# Altium project Luchador Rev 3.2old.PrjPcb
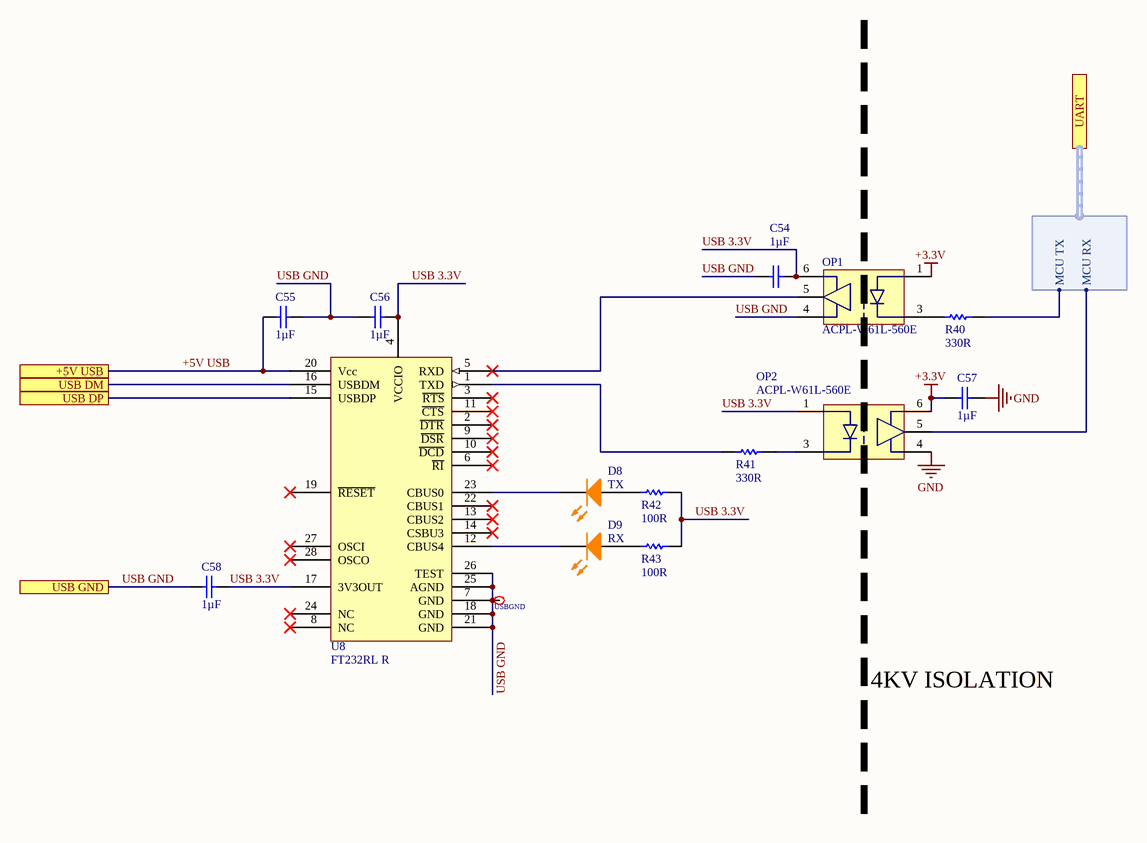
[diagram p0: Isolated USB.SchDoc]
PCBDOC: XXXXXX; PCBREV: 3.2b; PRJCOMPANY: X; PRJDATE: 3-15-19; PRJDOC: XXXXXX; PRJENGINEER: N. HAMAN; PRJNAME: AMBER; PRJREV: 3.2b
2 sheets, 35 parts. Net scope: hierarchical (ports join the sheet entries above them; power ports are global).
Board file: Luchador Pcb.PcbDoc
Sheets:
  Isolated USB.SchDoc
  DAQ System.SchDoc

## Sheet Isolated USB.SchDoc
size A4; SheetNumber: 4; SheetTotal: 11; TitleBlk1Sch: PCBA, LUCHADOR, REV 3.2b, AMBER; TitleBlk2Sch: Isolated USB; Eng: Haman; EngDate: 3-15-19; RevSch: 01

### Parts
C54  Capacitance: 1µF  [0402C]  (hidden comment: 50V)
C55  Capacitance: 1µF  [0402C]  (hidden comment: 50V)
C56  Capacitance: 1µF  [0402C]  (hidden comment: 50V)
C57  Capacitance: 1µF  [0402C]  (hidden comment: 50V)
C58  Capacitance: 1µF  [0402C]  (hidden comment: 50V)
D8  TX  [0402L-ORANGE]
D9  RX  [0402L-ORANGE]
OP1  ACPL-W61L-560E  [SO-6S]
OP2  ACPL-W61L-560E  [SO-6S]
R40  Resistance: 330R  [0402R]  (hidden comment: Res 0805)
R41  Resistance: 330R  [0402R]  (hidden comment: Res 0805)
R42  Resistance: 100R  [0402R]  (hidden comment: Res 0805)
R43  Resistance: 100R  [0402R]  (hidden comment: Res 0805)
U8  FT232RL R  [FTDI-28]
USBGND  5001  [KEYSTONE TP]  (value not drawn)  (no BOM)

### Ports
+5V USB, UART (harness UART), USB DM, USB DP, USB GND

### Harnesses
UART: MCU TX, MCU RX

### Nets
+3.3V: C57.1 OP1.1(A) OP2.6(Vdd)
GND: C57.2 OP2.4(GND)
+5V USB: C55.1 U8.20(Vcc) ; port +5V USB
USB 3.3V: C54.2 C56.2 C58.2 OP1.6(Vdd) OP2.1(A) R42.2 R43.2 U8.4(VCCIO) U8.17(3V3OUT)
USB GND: C54.1 C55.2 C56.1 C58.1 OP1.4(GND) U8.7(GND) U8.18(GND) U8.21(GND) U8.25(AGND) U8.26(TEST) USBGND.1 ; port USB GND
NetD8_1: D8.1(A) R42.1
NetD8_2: D8.2(K) U8.23(CBUS0)
NetD9_1: D9.1(A) R43.1
NetD9_2: D9.2(K) U8.12(CBUS4)
NetOP1_3: OP1.3(C) R40.1
NetOP1_5: OP1.5(Vo) U8.5(RXD)
NetOP2_3: OP2.3(C) R41.2
NetOP2_5: OP2.5(Vo) ; port UART.MCU RX
NetR40_2: R40.2 ; port UART.MCU TX
NetR41_1: R41.1 U8.1(TXD)
NetU8_15: U8.15(USBDP) ; port USB DP
NetU8_16: U8.16(USBDM) ; port USB DM

Not connected (* = marked no-connect by the designer): U8 2(~{DTR})* 3(~{RTS})* 6(~{RI})* 8(NC)* 9(~{DSR})* 10(~{DCD})* 11(~{CTS})* 13(CBUS2)* 14(CSBU3)* 19(~{RESET})* 22(CBUS1)* 24(NC)* 27(OSCI)* 28(OSCO)*

### Notes on the sheet
- 4KV ISOLATION
- Title:
- USA
- 100 Mayfield Avenue
- Mountain View, CA 94043
- Variant Name:
- Confidential and Proprietary
- Engineer:
- Date:
- Size:
- A4
- Template:
- 992-00283-00 A
- Dwg No:
- Sheet:
- Rev:
- of

### Library data of the parts
C54-C58 = Cap: CAP .1UF 50V CERAMIC Y5V 0805; Manufacturer: TDK; Manufacturer Part Number: CGB2A1JB1C105K033BC; PCN Part Number: MLCC Part Number Change 30/Nov/2012; Description1: 1µF ±10% 16V JB Ceramic Capacitor -25°C ~ 85°C Surface Mount, MLCC 0402 (1005 Metric) 0.039" L x 0.020" W (1.00mm x 0.50mm); Product Training Modules: SEAT, CCV, and TVCL Design Tools Guide to Replacing an Electrolytic Capacitor with an MLCC; Featured Product: CGB Series Capacitors CH and JB Temperature Coefficient Capacitors; EDA / CAD Models: Download from Accelerated Designs; Tolerance: ±10%; Voltage - Rated: 16V; Temperature Coefficient: JB; Online Catalog: CGB Series; Other Names: 445-12011-6; Revision: July-2002: Re-released for DXP Platform.; Supplier 1: Digi-Key; Supplier Part Number 1: 445-12011-1-ND; Stock 1: 7430; Pricing 1: 1=0.22, 10=0.151, 100=0.0765, 500=0.0523, 1000=0.0463, 2500=0.0443, 5000=0.0403 (USD); RoHS Information: RoHS Certificate-MLCC; Standard Package: 1; Category: Capacitors; Family: Ceramic Capacitors; Series: CGB; Packaging: Digi-Reel®; Mounting Type: Surface Mount, MLCC; Operating Temperature: -25°C ~ 85°C; Applications: General Purpose; Package / Case: 0402 (1005 Metric); Size / Dimension: 0.039" L x 0.020" W (1.00mm x 0.50mm); Thickness (Max): 0.013" (0.33mm); Features: Low Profile; ComponentLink1URL: https://product.tdk.com/info/en/catalog/datasheets/mlcc_commercial_lowprofile_en.pdf; ComponentLink1Description: https://product.tdk.com/info/en/catalog/datasheets/mlcc_commercial_lowprofile_en.pdf; ComponentLink2URL: https://product.tdk.com/info/en/catalog/spec/mlccspec_commercial_lowprofile_en.pdf; ComponentLink2Description: https://product.tdk.com/info/en/catalog/spec/mlccspec_commercial_lowprofile_en.pdf; ComponentLink3URL: http://product.tdk.com/en/catalog/datasheets/mlcc_commercial_lowprofile_en.pdf; ComponentLink3Description: http://product.tdk.com/en/catalog/datasheets/mlcc_commercial_lowprofile_en.pdf
D8 D9 = LED0_1: Typical INFRARED GaAs LED; Manufacturer: Vishay; Manufacturer Part Number: VLMO1500-GS08; Description1: Standard LEDs - SMD 0402 SOFT ORANGE Non-Diff; Illumination Color: Orange; Wavelength/Color Temperature: 605 nm; Luminous Intensity: 90 mcd; Viewing Angle: 130 deg; Lens Color/Style: Water Clear; If - Forward Current: 30 mA; Vf - Forward Voltage: 2 V; Power Rating: 75 mW; Brand: Vishay Semiconductors; Supplier 1: Digi-Key; Supplier Part Number 1: VLMO1500-GS08CT-ND; Stock 1: 194938; Pricing 1: 1=0.53, 10=0.38, 25=0.2916, 100=0.1901, 250=0.1394, 500=0.1183, 1000=0.0972 (USD); Product Category: Standard LEDs - SMD; RoHS: True; Package / Case: 0402 (1005 metric); Length: 1 mm; Height: 0.35 mm; Width: 0.5 mm; Minimum Operating Temperature: - 30 C; Maximum Operating Temperature: + 85 C; Series: VLMx; Packaging: Reel; Mounting Style: SMD/SMT; Factory Pack Quantity: 9000; Tradename: ChipLED; ComponentLink1URL: https://datasheet.ciiva.com/13945/vlmo1500-13945355.pdf; ComponentLink1Description: https://datasheet.ciiva.com/13945/vlmo1500-13945355.pdf; ComponentLink2URL: https://datasheet.ciiva.com/13945/vlmo1500-13945356.pdf; ComponentLink2Description: https://datasheet.ciiva.com/13945/vlmo1500-13945356.pdf; ComponentLink3URL: https://datasheet.ciiva.com/13945/vlmo1500-13945357.pdf; ComponentLink3Description: https://datasheet.ciiva.com/13945/vlmo1500-13945357.pdf
OP1 OP2 = ACPL-W61L-560E: Manufacturer: Broadcom Limited; Description1: OPTOISO 5KV PUSH PULL 6SO; Inputs - Side 1/Side 2: 1/0; Voltage - Isolation: 5000Vrms; Common Mode Transient Immunity (Min): 20kV/µs; Input Type: DC; Output Type: Push-Pull, Totem Pole; Data Rate: 10MBd; Propagation Delay tpLH / tpHL (Max): 80ns, 80ns; Rise / Fall Time (Typ): 12ns, 12ns; Voltage - Forward (Vf) (Typ): 1.3V; Current - DC Forward (If) (Max): 8mA; Voltage - Supply: 2.7 V ~ 5.5 V; Supplier 1: Digi-Key; Supplier Part Number 1: 516-2633-1-ND; RoHS: RoHS Compliant; Category: Isolators; Stock 1: 23625; Pricing 1: 1=3.6, 10=3, 25=2.52, 100=2.1598, 250=1.91984, 500=1.73986 (USD); Packaging: Cut Tape (CT); Part Status: Active; Operating Temperature: -40°C ~ 105°C; Mounting Type: Surface Mount; Package / Case: 6-SOIC (0.180", 4.58mm Width); Supplier Device Package: 6-SO Stretched; ComponentLink1URL: https://docs.broadcom.com/docs/AV02-2150EN; ComponentLink1Description: https://docs.broadcom.com/docs/AV02-2150EN; Manufacturer Part Number: ACPL-W61L-560E
R40 R41 = Res 0805: Resistor; Manufacturer: Panasonic; Manufacturer Part Number: ERJ-2RKF3300X; Description1: Res Thick Film 0402 330 Ohm 1% 0.1W(1/10W) ±100ppm/C Molded SMD Automotive Punched T/R; Resistor Element Type: Thick Film; Product Range: PANASONIC - ERJ Series; Power Rating: 100mW; Resistance Tolerance: ± 1%; Resistor Case Style: 0402 [1005 Metric]; Temperature Coefficient: ± 100ppm/°C; Voltage Rating: 50V; SVHC: Diboron trioxide (19-Dec-2012); Resistor Mounting: SMD; Resistor Terminals: Wraparound; SVHC (Secondary): Lead monoxide (lead oxide) (19-Dec-2012); Supplier 1: Digi-Key; Supplier Part Number 1: P330LCT-ND; Stock 1: 634394; Pricing 1: 1=0.1, 10=0.056, 100=0.0227, 1000=0.0102, 2500=0.0089, 5000=0.0073 (USD); Resistor Element Material: Thick Film; Packaging: Cut Tape; MSL: (Not Applicable); ComponentLink1URL: https://datasheet.ciiva.com/11821/0900766b80f80784-11821296.pdf; ComponentLink1Description: https://datasheet.ciiva.com/11821/0900766b80f80784-11821296.pdf; ComponentLink2URL: https://datasheet.ciiva.com/16765/70260748-16765702.pdf; ComponentLink2Description: https://datasheet.ciiva.com/16765/70260748-16765702.pdf; ComponentLink3URL: https://datasheet.ciiva.com/17206/aoa0000ce2-17206150.pdf; ComponentLink3Description: https://datasheet.ciiva.com/17206/aoa0000ce2-17206150.pdf; ComponentLink4URL: https://datasheet.ciiva.com/30088/aoa0000ce2-30088246.pdf; ComponentLink4Description: https://datasheet.ciiva.com/30088/aoa0000ce2-30088246.pdf; ComponentLink5URL: https://datasheet.ciiva.com/6138/aoa0000ce2-6138743.pdf; ComponentLink5Description: https://datasheet.ciiva.com/6138/aoa0000ce2-6138743.pdf; ComponentLink6URL: https://datasheet.ciiva.com/46373/1678782-46373913.pdf; ComponentLink6Description: https://datasheet.ciiva.com/46373/1678782-46373913.pdf; ComponentLink7URL: https://datasheet.ciiva.com/7887/aoa0000ce2-7887018.pdf; ComponentLink7Description: https://datasheet.ciiva.com/7887/aoa0000ce2-7887018.pdf; ComponentLink8URL: https://datasheet.ciiva.com/46373/1678782-46373914.pdf; ComponentLink8Description: https://datasheet.ciiva.com/46373/1678782-46373914.pdf; ComponentLink9URL: https://datasheet.ciiva.com/16426/aoa0000ce2-16426749.pdf; ComponentLink9Description: https://datasheet.ciiva.com/16426/aoa0000ce2-16426749.pdf; ComponentLink10URL: https://datasheet.ciiva.com/7886/aoa0000ce2-7886718.pdf; ComponentLink10Description: https://datasheet.ciiva.com/7886/aoa0000ce2-7886718.pdf; ComponentLink11URL: https://datasheet.ciiva.com/22706/1678782-22706926.pdf; ComponentLink11Description: https://datasheet.ciiva.com/22706/1678782-22706926.pdf
R42 R43 = Res 0805: Resistor; Manufacturer: Panasonic; Manufacturer Part Number: ERJ-2RKF1000X; Description1: Res Thick Film 0402 100 Ohm 1% 0.1W(1/10W) ±100ppm/C Molded SMD Automotive T/R; Rated Power: 0.1 W; Tolerance (%): ±1 %; Temp Coefficient: ±100 ppm/°C; Supplier 1: Digi-Key; Supplier Part Number 1: P100LCT-ND; Stock 1: 14075966; Pricing 1: 1=0.1, 10=0.056, 100=0.0227, 1000=0.0102, 2500=0.0089, 5000=0.0073 (USD); Size Code: 0402; ComponentLink1URL: https://datasheet.ciiva.com/27056/2007311-27056035.pdf; ComponentLink1Description: https://datasheet.ciiva.com/27056/2007311-27056035.pdf; ComponentLink2URL: https://datasheet.ciiva.com/11821/0900766b80f80784-11821173.pdf; ComponentLink2Description: https://datasheet.ciiva.com/11821/0900766b80f80784-11821173.pdf; ComponentLink3URL: https://datasheet.ciiva.com/46372/1678782-46372741.pdf; ComponentLink3Description: https://datasheet.ciiva.com/46372/1678782-46372741.pdf; ComponentLink4URL: https://datasheet.ciiva.com/16199/aoa0000ce2-16199575.pdf; ComponentLink4Description: https://datasheet.ciiva.com/16199/aoa0000ce2-16199575.pdf; ComponentLink5URL: https://datasheet.ciiva.com/43467/1678782-43467223.pdf; ComponentLink5Description: https://datasheet.ciiva.com/43467/1678782-43467223.pdf; ComponentLink6URL: https://datasheet.ciiva.com/30260/aoa0000ce2-30260809.pdf; ComponentLink6Description: https://datasheet.ciiva.com/30260/aoa0000ce2-30260809.pdf; ComponentLink7URL: https://datasheet.ciiva.com/9186/aoa0000ce2-9186683.pdf; ComponentLink7Description: https://datasheet.ciiva.com/9186/aoa0000ce2-9186683.pdf; ComponentLink8URL: https://datasheet.ciiva.com/16776/70260748-16776427.pdf; ComponentLink8Description: https://datasheet.ciiva.com/16776/70260748-16776427.pdf; ComponentLink9URL: https://datasheet.ciiva.com/48531/aoa0000ce2-48531067.pdf; ComponentLink9Description: https://datasheet.ciiva.com/48531/aoa0000ce2-48531067.pdf; ComponentLink10URL: https://datasheet.ciiva.com/17207/aoa0000ce2-17207980.pdf; ComponentLink10Description: https://datasheet.ciiva.com/17207/aoa0000ce2-17207980.pdf; ComponentLink11URL: https://datasheet.ciiva.com/7830/426256-7830973.pdf; ComponentLink11Description: https://datasheet.ciiva.com/7830/426256-7830973.pdf; ComponentLink12URL: https://datasheet.ciiva.com/16522/aoa0000ce2-16522621.pdf; ComponentLink12Description: https://datasheet.ciiva.com/16522/aoa0000ce2-16522621.pdf; ComponentLink13URL: https://datasheet.ciiva.com/28514/1678782-28514175.pdf; ComponentLink13Description: https://datasheet.ciiva.com/28514/1678782-28514175.pdf
U8 = FT232RL R: IC USB TO SERIAL UART 28-SSOP; Manufacturer: FTDI, Future Technology Devices International Ltd; Manufacturer Part Number: FT232RL-REEL; Description1: IC USB FS SERIAL UART 28-SSOP; Number of Channels: 1, UART; FIFO's: 256 Byte; Protocol: RS-232, RS-422, RS-485; Voltage - Supply: 3.3 V ~ 5.25 V; With Auto Flow Control: Yes; Supplier 1: Digi-Key; Supplier Part Number 1: 768-1007-1-ND; RoHS: RoHS Compliant; Category: Integrated Circuits (ICs); Stock 1: 60399; Pricing 1: 1=4.5, 10=4.05, 50=3.85, 100=3.65, 250=3.25, 500=2.85 (USD); Features: USB to UART; With Parallel Port: -; With IrDA Encoder/Decoder: -; With False Start Bit Detection: -; With Modem Control: Yes; With CMOS: Yes; Mounting Type: Surface Mount; Package / Case: 28-SSOP; Supplier Device Package: 28-SSOP; Packaging: Cut Tape (CT); ComponentLink1URL: http://www.ftdichip.com/Support/Documents/DataSheets/ICs/DS_FT232R.pdf; ComponentLink1Description: http://www.ftdichip.com/Support/Documents/DataSheets/ICs/DS_FT232R.pdf
USBGND = 5001: Manufacturer: Keystone Electronics; Description1: TEST POINT PC MINI .040"D BLACK; Supplier 1: Digi-Key; Manufacturer Part Number: 5001; RoHS: RoHS Compliant; Category: Test and Measurement; Stock 1: 159085; Pricing 1: 1=0.34, 10=0.315, 50=0.2296, 100=0.2206, 250=0.19812, 500=0.1891, 1000=0.15759, 2500=0.14408, 5000=0.13508 (USD); Packaging: Bulk; Type: PC Test Point, Miniature; Terminal: 0.010" x 0.020" (0.25mm x 0.51mm) Phosphor Bronze Wire, Silver Plated; Mounting Type: 0.040" (1.02mm) Hole Diameter; Material: Base, Nylon 46, UL 94V-0; Color: Black; ComponentLink1URL: http://www.keyelco.com/product-pdf.cfm?p=1310; ComponentLink1Description: http://www.keyelco.com/product-pdf.cfm?p=1310; Supplier Part Number 1: 5001K-ND

## Sheet DAQ System.SchDoc
size B; SheetNumber: 5; SheetTotal: 11; TitleBlk1Sch: PCBA, LUCHADOR, REV 3.2b, AMBER; TitleBlk2Sch: DAQ System; Eng: Haman; EngDate: 3-15-19; RevSch: 01
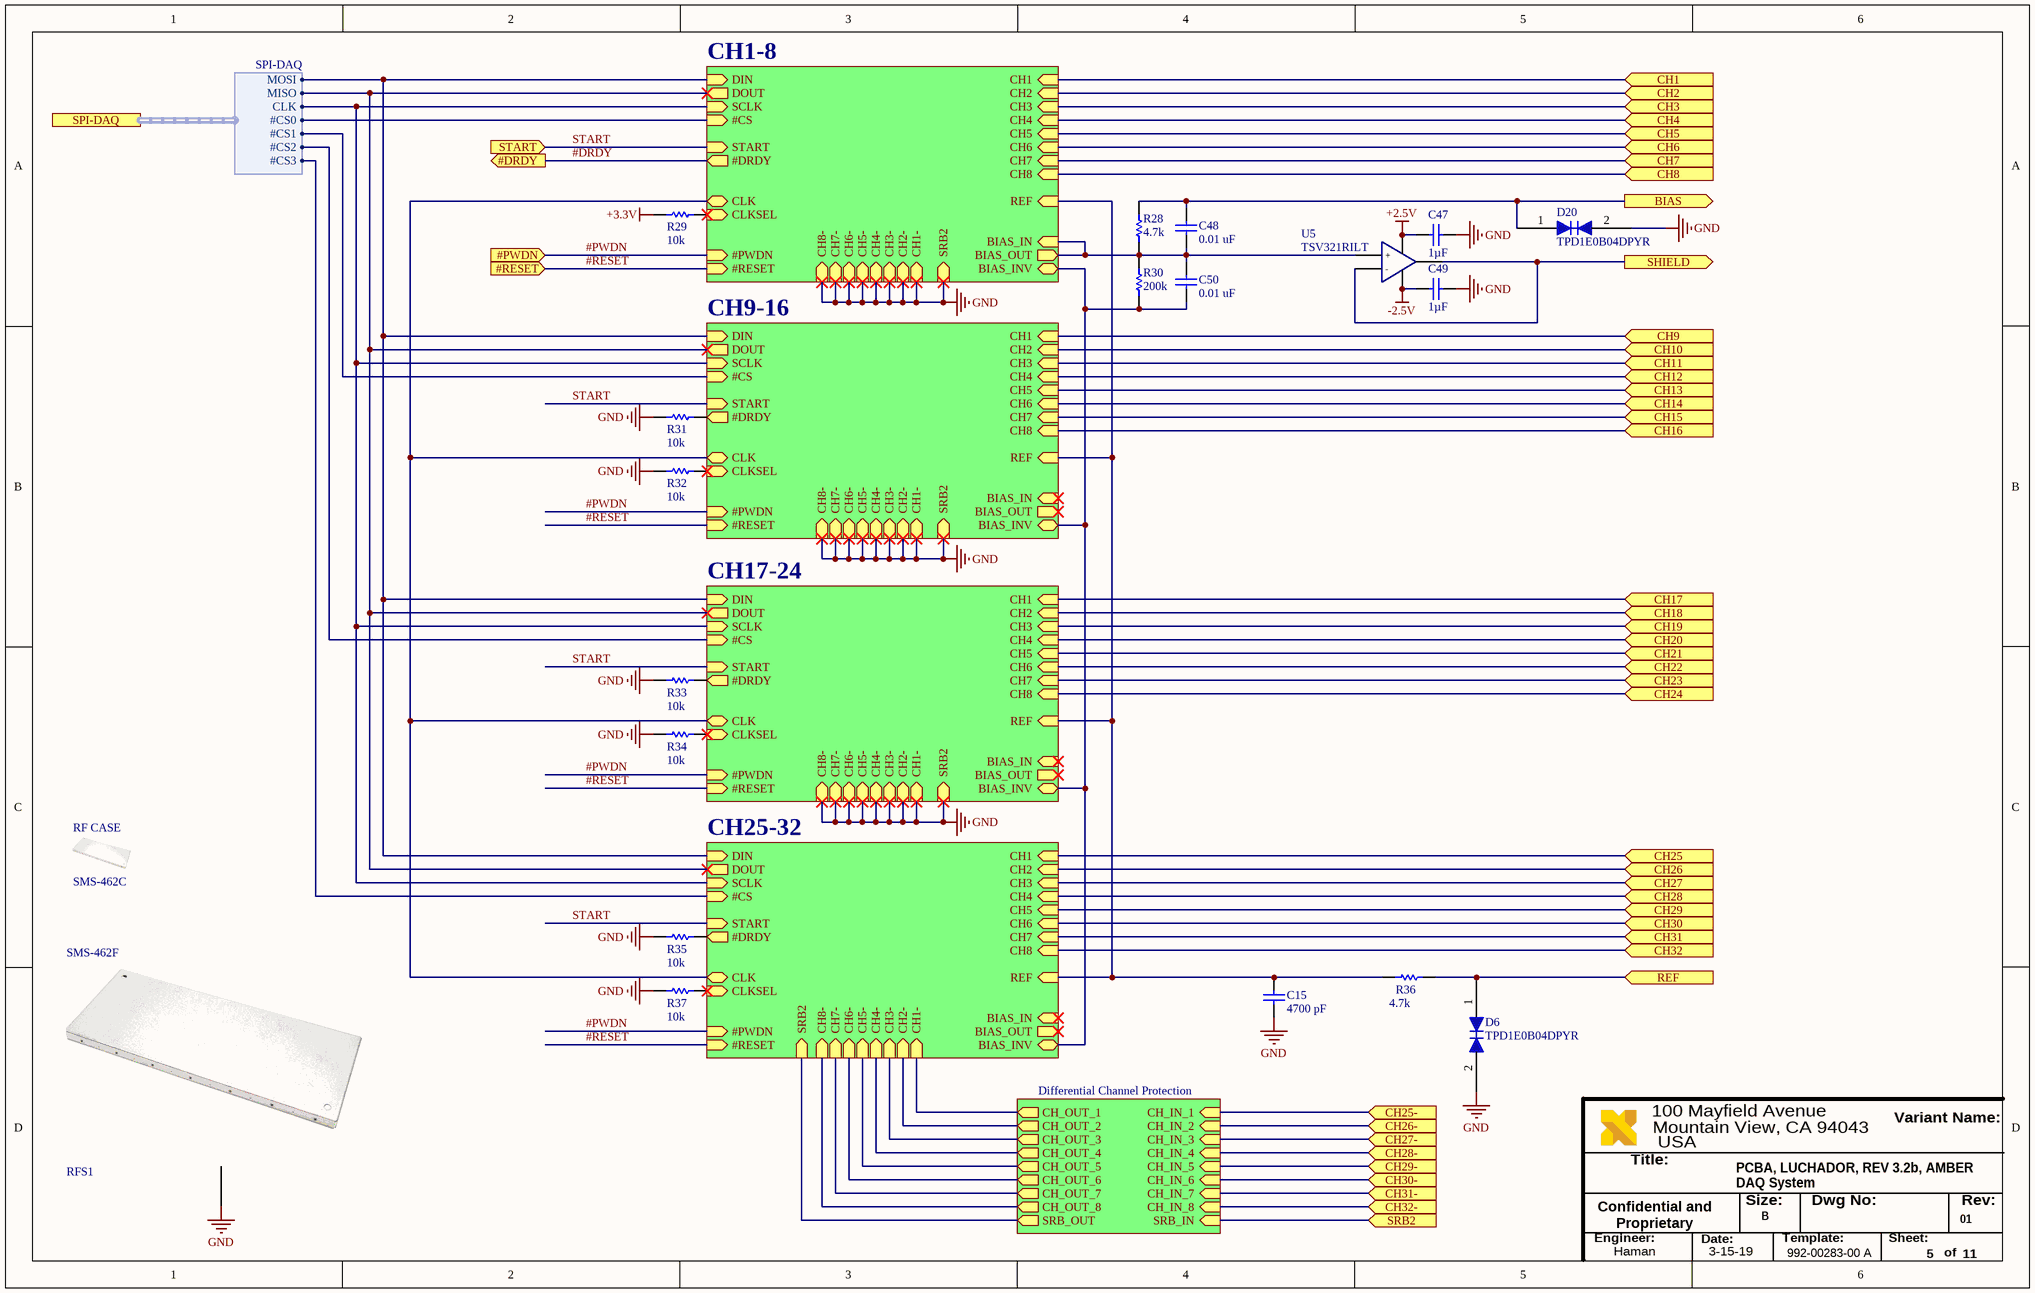
[diagram p1: DAQ System.SchDoc]

### Parts
C15  Capacitance: 4700 pF  [0402C]  (hidden comment: 50V)
C47  Capacitance: 1µF  [0402C]  (hidden comment: 50V)
C48  Capacitance: 0.01 uF  [0402C]  (hidden comment: 50V)
C49  Capacitance: 1µF  [0402C]  (hidden comment: 50V)
C50  Capacitance: 0.01 uF  [0402C]  (hidden comment: 50V)
D6  TPD1E0B04DPYR  [0402D]
D20  TPD1E0B04DPYR  [0402D]
R28  Resistance Value: 4.7k  [0402R]  (hidden comment: Res 0805)
R29  Resistance: 10k  [0402R]  (hidden comment: Res 0805)
R30  Resistance: 200k  [0402R]  (hidden comment: Res 0805)
R31  Resistance: 10k  [0402R]  (hidden comment: Res 0805)
R32  Resistance: 10k  [0402R]  (hidden comment: Res 0805)
R33  Resistance: 10k  [0402R]  (hidden comment: Res 0805)
R34  Resistance: 10k  [0402R]  (hidden comment: Res 0805)
R35  Resistance: 10k  [0402R]  (hidden comment: Res 0805)
R36  Resistance Value: 4.7k  [0402R]  (hidden comment: Res 0805)
R37  Resistance: 10k  [0402R]  (hidden comment: Res 0805)
RF_CASE  SMS-462C  (mechanical)
RFS1  Component_1  [SMS-462F]  (value not drawn)
U5  TSV321RILT  [SOT-23-5]

### Sub-sheets
CH1-8 = 8CH EEG.SchDoc (file not in this document): CH1 (in), CH2 (in), CH3 (in), CH4 (in), CH5 (in), CH6 (in), CH7 (in), CH8 (in), REF (in), BIAS_INV (bidir), BIAS_OUT (out), BIAS_IN (in), SRB2 (in), CH1- (in), CH2- (in), CH3- (in), CH4- (in), CH5- (in), CH6- (in), CH7- (in), CH8- (in), DIN (in), DOUT (out), SCLK (in), #CS (in), #DRDY (out), START (in), CLK (bidir), CLKSEL (in), #PWDN (in), #RESET (in)
CH9-16 = 8CH EEG.SchDoc (file not in this document): CH1 (in), CH2 (in), CH3 (in), CH4 (in), CH5 (in), CH6 (in), CH7 (in), CH8 (in), REF (in), BIAS_INV (bidir), BIAS_OUT (out), BIAS_IN (in), SRB2 (in), CH1- (in), CH2- (in), CH3- (in), CH4- (in), CH5- (in), CH6- (in), CH7- (in), CH8- (in), DIN (in), DOUT (out), SCLK (in), #CS (in), #DRDY (out), START (in), CLK (bidir), CLKSEL (in), #PWDN (in), #RESET (in)
CH17-24 = 8CH EEG.SchDoc (file not in this document): CH1 (in), CH2 (in), CH3 (in), CH4 (in), CH5 (in), CH6 (in), CH7 (in), CH8 (in), REF (in), BIAS_INV (bidir), BIAS_OUT (out), BIAS_IN (in), SRB2 (in), CH1- (in), CH2- (in), CH3- (in), CH4- (in), CH5- (in), CH6- (in), CH7- (in), CH8- (in), DIN (in), DOUT (out), SCLK (in), #CS (in), #DRDY (out), START (in), CLK (bidir), CLKSEL (in), #PWDN (in), #RESET (in)
CH25-32 = 8CH EEG.SchDoc (file not in this document): CH1 (in), CH2 (in), CH3 (in), CH4 (in), CH5 (in), CH6 (in), CH7 (in), CH8 (in), REF (in), BIAS_INV (bidir), BIAS_OUT (out), BIAS_IN (in), SRB2 (in), CH1- (in), CH2- (in), CH3- (in), CH4- (in), CH5- (in), CH6- (in), CH7- (in), CH8- (in), DIN (in), DOUT (out), SCLK (in), #CS (in), #DRDY (out), START (in), CLK (bidir), CLKSEL (in), #PWDN (in), #RESET (in)
Differential Channel Protection = Differential Channel Protection.SchDoc (file not in this document): CH_IN_1 (in), CH_IN_2 (in), CH_IN_3 (in), CH_IN_4 (in), CH_IN_5 (in), CH_IN_6 (in), CH_IN_7 (in), CH_IN_8 (in), SRB_IN (in), CH_OUT_1 (out), CH_OUT_2 (out), CH_OUT_3 (out), CH_OUT_4 (out), CH_OUT_5 (out), CH_OUT_6 (out), CH_OUT_7 (out), CH_OUT_8 (out), SRB_OUT (out)

### Ports
#DRDY (out), #PWDN (in), #RESET (in), BIAS (out), CH1 (in), CH2 (in), CH3 (in), CH4 (in), CH5 (in), CH6 (in), CH7 (in), CH8 (in), CH9 (in), CH10 (in), CH11 (in), CH12 (in), CH13 (in), CH14 (in), CH15 (in), CH16 (in), CH17 (in), CH18 (in), CH19 (in), CH20 (in), CH21 (in), CH22 (in), CH23 (in), CH24 (in), CH25 (in), CH25- (in), CH26 (in), CH26- (in), CH27 (in), CH27- (in), CH28 (in), CH28- (in), CH29 (in), CH29- (in), CH30 (in), CH30- (in), CH31 (in), CH31- (in), CH32 (in), CH32- (in), REF (in), SHIELD (out), SPI-DAQ (harness SPI-DAQ), SRB2 (in), START (in)

### Harnesses
SPI-DAQ: MOSI, MISO, CLK, #CS0, #CS1, #CS2, #CS3

### Nets
+2.5V: C47.2 U5.5(VCC)
+3.3V: R29.1
-2.5V: C49.2 U5.2(VDD)
GND: C15.1 C47.1 C49.1 D6.2(GND) D20.2(GND) R31.1 R32.1 R33.1 R34.1 R35.1 R37.1 RFS1.M ; sheet CH1-8/SRB2, sheet CH1-8/CH1-, sheet CH1-8/CH2-, sheet CH1-8/CH3-, sheet CH1-8/CH4-, sheet CH1-8/CH5-, sheet CH1-8/CH6-, sheet CH1-8/CH7-, sheet CH1-8/CH8-, sheet CH9-16/SRB2, sheet CH9-16/CH1-, sheet CH9-16/CH2-, sheet CH9-16/CH3-, sheet CH9-16/CH4-, sheet CH9-16/CH5-, sheet CH9-16/CH6-, sheet CH9-16/CH7-, sheet CH9-16/CH8-, sheet CH17-24/SRB2, sheet CH17-24/CH1-, sheet CH17-24/CH2-, sheet CH17-24/CH3-, sheet CH17-24/CH4-, sheet CH17-24/CH5-, sheet CH17-24/CH6-, sheet CH17-24/CH7-, sheet CH17-24/CH8-
#DRDY: port #DRDY, sheet CH1-8/#DRDY
#PWDN: port #PWDN, sheet CH1-8/#PWDN, sheet CH9-16/#PWDN, sheet CH17-24/#PWDN, sheet CH25-32/#PWDN
#RESET: port #RESET, sheet CH1-8/#RESET, sheet CH9-16/#RESET, sheet CH17-24/#RESET, sheet CH25-32/#RESET
START: port START, sheet CH1-8/START, sheet CH9-16/START, sheet CH17-24/START, sheet CH25-32/START
NetC15_2: C15.2 R36.1 ; sheet CH1-8/REF, sheet CH9-16/REF, sheet CH17-24/REF, sheet CH25-32/REF
NetC48_1: C48.1 D20.1(IO1) R28.2 ; port BIAS
NetC48_2: C48.2 C50.2 R28.1 R30.2 U5.3(+) ; sheet CH1-8/BIAS_OUT, sheet CH1-8/BIAS_IN
NetC50_1: C50.1 R30.1 ; sheet CH1-8/BIAS_INV, sheet CH9-16/BIAS_INV, sheet CH17-24/BIAS_INV, sheet CH25-32/BIAS_INV
NetD6_1: D6.1(IO1) R36.2 ; port REF
NetR29_2: R29.2 ; sheet CH1-8/CLKSEL
NetR31_2: R31.2 ; sheet CH9-16/#DRDY
NetR32_2: R32.2 ; sheet CH9-16/CLKSEL
NetR33_2: R33.2 ; sheet CH17-24/#DRDY
NetR34_2: R34.2 ; sheet CH17-24/CLKSEL
NetR35_2: R35.2 ; sheet CH25-32/#DRDY
NetR37_2: R37.2 ; sheet CH25-32/CLKSEL
NetU5_1: U5.1(OUT) U5.4(-) ; port SHIELD
(unnamed): port CH3, sheet CH1-8/CH3
(unnamed): port CH4, sheet CH1-8/CH4
(unnamed): port CH5, sheet CH1-8/CH5
(unnamed): port CH6, sheet CH1-8/CH6
(unnamed): port CH10, sheet CH9-16/CH2
(unnamed): port CH11, sheet CH9-16/CH3
(unnamed): port CH7, sheet CH1-8/CH7
(unnamed): port CH8, sheet CH1-8/CH8
(unnamed): port CH9, sheet CH9-16/CH1
(unnamed): port CH12, sheet CH9-16/CH4
(unnamed): port CH14, sheet CH9-16/CH6
(unnamed): port CH13, sheet CH9-16/CH5
(unnamed): port CH16, sheet CH9-16/CH8
(unnamed): port CH17, sheet CH17-24/CH1
(unnamed): port CH15, sheet CH9-16/CH7
(unnamed): port CH18, sheet CH17-24/CH2
(unnamed): port CH20, sheet CH17-24/CH4
(unnamed): port CH21, sheet CH17-24/CH5
(unnamed): port CH22, sheet CH17-24/CH6
(unnamed): port CH23, sheet CH17-24/CH7
(unnamed): port CH24, sheet CH17-24/CH8
(unnamed): port CH19, sheet CH17-24/CH3
(unnamed): port CH25, sheet CH25-32/CH1
(unnamed): port CH26, sheet CH25-32/CH2
(unnamed): port CH27, sheet CH25-32/CH3
(unnamed): port CH29, sheet CH25-32/CH5
(unnamed): port CH30, sheet CH25-32/CH6
(unnamed): port CH31, sheet CH25-32/CH7
(unnamed): port CH28, sheet CH25-32/CH4
(unnamed): port CH32, sheet CH25-32/CH8
(unnamed): port CH1, sheet CH1-8/CH1
(unnamed): port CH2, sheet CH1-8/CH2
(unnamed): port CH25-, sheet Differential Channel Protection/CH_IN_1
(unnamed): port CH26-, sheet Differential Channel Protection/CH_IN_2
(unnamed): port CH27-, sheet Differential Channel Protection/CH_IN_3
(unnamed): port CH28-, sheet Differential Channel Protection/CH_IN_4
(unnamed): port CH29-, sheet Differential Channel Protection/CH_IN_5
(unnamed): port CH30-, sheet Differential Channel Protection/CH_IN_6
(unnamed): port CH31-, sheet Differential Channel Protection/CH_IN_7
(unnamed): port CH32-, sheet Differential Channel Protection/CH_IN_8
(unnamed): port SRB2, sheet Differential Channel Protection/SRB_IN
(unnamed): sheet CH1-8/DIN, sheet CH9-16/DIN, sheet CH17-24/DIN, sheet CH25-32/DIN, port SPI-DAQ.MOSI
(unnamed): sheet CH1-8/DOUT, sheet CH9-16/DOUT, sheet CH17-24/DOUT, sheet CH25-32/DOUT, port SPI-DAQ.MISO
(unnamed): sheet CH1-8/SCLK, sheet CH9-16/SCLK, sheet CH17-24/SCLK, sheet CH25-32/SCLK, port SPI-DAQ.CLK
(unnamed): sheet CH1-8/#CS, port SPI-DAQ.#CS0
(unnamed): sheet CH1-8/CLK, sheet CH9-16/CLK, sheet CH17-24/CLK, sheet CH25-32/CLK
(unnamed): sheet CH9-16/#CS, port SPI-DAQ.#CS1
(unnamed): sheet CH17-24/#CS, port SPI-DAQ.#CS2
(unnamed): sheet CH25-32/SRB2, sheet Differential Channel Protection/SRB_OUT
(unnamed): sheet CH25-32/CH1-, sheet Differential Channel Protection/CH_OUT_1
(unnamed): sheet CH25-32/CH2-, sheet Differential Channel Protection/CH_OUT_2
(unnamed): sheet CH25-32/CH3-, sheet Differential Channel Protection/CH_OUT_3
(unnamed): sheet CH25-32/CH4-, sheet Differential Channel Protection/CH_OUT_4
(unnamed): sheet CH25-32/CH5-, sheet Differential Channel Protection/CH_OUT_5
(unnamed): sheet CH25-32/CH6-, sheet Differential Channel Protection/CH_OUT_6
(unnamed): sheet CH25-32/CH7-, sheet Differential Channel Protection/CH_OUT_7
(unnamed): sheet CH25-32/CH8-, sheet Differential Channel Protection/CH_OUT_8
(unnamed): sheet CH25-32/#CS, port SPI-DAQ.#CS3

### Notes on the sheet
- Title:
- USA
- 100 Mayfield Avenue
- Mountain View, CA 94043
- Variant Name:
- Confidential and Proprietary
- Engineer:
- Date:
- Size:
- B
- Template:
- 992-00283-00 A
- Dwg No:
- Sheet:
- Rev:
- of

### Library data of the parts
C15 = Cap: CAP .1UF 50V CERAMIC Y5V 0805; Manufacturer: Murata; Manufacturer Part Number: GCM155R71H472KA37D; Description1: CAP CER 4700PF 50V X7R 0402; Dielectric: X7R; Tolerance (%): ±10 %; Revision: July-2002: Re-released for DXP Platform.; Supplier 1: Digi-Key; Supplier Part Number 1: 490-4915-1-ND; Stock 1: 100000; Pricing 1: 1=0.1, 10=0.047, 100=0.021, 500=0.015, 1000=0.0118, 2500=0.0107, 5000=0.0099 (USD); Case Size/Dimension: 0402; Rated Voltage: 50 V; ComponentLink1URL: https://datasheet.ciiva.com/26843/getdatasheetpartid-724237-26843665.pdf; ComponentLink1Description: https://datasheet.ciiva.com/26843/getdatasheetpartid-724237-26843665.pdf; ComponentLink2URL: https://datasheet.ciiva.com/17453/product-17453667.pdf; ComponentLink2Description: https://datasheet.ciiva.com/17453/product-17453667.pdf; ComponentLink3URL: https://datasheet.ciiva.com/2989/product-2989236.pdf; ComponentLink3Description: https://datasheet.ciiva.com/2989/product-2989236.pdf; ComponentLink4URL: https://datasheet.ciiva.com/155/product-155869.pdf; ComponentLink4Description: https://datasheet.ciiva.com/155/product-155869.pdf; ComponentLink5URL: https://datasheet.ciiva.com/16440/product-16440397.pdf; ComponentLink5Description: https://datasheet.ciiva.com/16440/product-16440397.pdf; ComponentLink6URL: https://datasheet.ciiva.com/155/product-155870.pdf; ComponentLink6Description: https://datasheet.ciiva.com/155/product-155870.pdf; ComponentLink7URL: https://datasheet.ciiva.com/155/product-155871.pdf; ComponentLink7Description: https://datasheet.ciiva.com/155/product-155871.pdf
C47 C49 = Cap: as C54 on sheet Isolated USB; Revision: July-2002: Re-released for DXP Platform.; Supplier 1: Digi-Key; Supplier Part Number 1: 445-12011-1-ND; Stock 1: 7430; Pricing 1: 1=0.22, 10=0.151, 100=0.0765, 500=0.0523, 1000=0.0463, 2500=0.0443, 5000=0.0403 (USD); RoHS Information: RoHS Certificate-MLCC; Standard Package: 1; Category: Capacitors; Family: Ceramic Capacitors; Series: CGB; Packaging: Digi-Reel®; Mounting Type: Surface Mount, MLCC; Operating Temperature: -25°C ~ 85°C; Applications: General Purpose; Package / Case: 0402 (1005 Metric); Size / Dimension: 0.039" L x 0.020" W (1.00mm x 0.50mm); Thickness (Max): 0.013" (0.33mm); Features: Low Profile; ComponentLink1URL: https://product.tdk.com/info/en/catalog/datasheets/mlcc_commercial_lowprofile_en.pdf; ComponentLink1Description: https://product.tdk.com/info/en/catalog/datasheets/mlcc_commercial_lowprofile_en.pdf; ComponentLink2URL: https://product.tdk.com/info/en/catalog/spec/mlccspec_commercial_lowprofile_en.pdf; ComponentLink2Description: https://product.tdk.com/info/en/catalog/spec/mlccspec_commercial_lowprofile_en.pdf; ComponentLink3URL: http://product.tdk.com/en/catalog/datasheets/mlcc_commercial_lowprofile_en.pdf; ComponentLink3Description: http://product.tdk.com/en/catalog/datasheets/mlcc_commercial_lowprofile_en.pdf
C48 C50 = Cap: CAP .1UF 50V CERAMIC Y5V 0805; Manufacturer: American Technical Ceramics; Manufacturer Part Number: 520L103KT16T; Part # Aliases: 520L103KT ATC520L103KT ATC520L103KT16T; Description1: Multilayer Ceramic Capacitors MLCC - SMD/SMT 16volts 0.01uF 10%; Voltage Rating DC: 16 VDC; Dielectric: X7R; Tolerance: 10 %; Brand: American Technical Ceramics (ATC); Type: Broadband Multilayer Capacitor; Revision: July-2002: Re-released for DXP Platform.; Supplier 1: Digi-Key; Supplier Part Number 1: 1284-1540-1-ND; Stock 1: 206115; Pricing 1: 1=0.98, 10=0.748, 100=0.535 (USD); Product Category: Multilayer Ceramic Capacitors MLCC - SMD/SMT; RoHS: Details; Case Code - in: 0402; Case Code - mm: 1005; Maximum Operating Temperature: + 125 C; Minimum Operating Temperature: - 55 C; Product: RF Microwave / High Q; Series: 520L; Package / Case: 0402 (1005 metric); Packaging: Reel; Factory Pack Quantity: 1000; Termination Style: SMD/SMT; ComponentLink1URL: https://datasheet.ciiva.com/15214/getdatasheetpartid-566935-15214265.pdf; ComponentLink1Description: https://datasheet.ciiva.com/15214/getdatasheetpartid-566935-15214265.pdf; ComponentLink2URL: https://datasheet.ciiva.com/24070/520l-261941-24070397.pdf; ComponentLink2Description: https://datasheet.ciiva.com/24070/520l-261941-24070397.pdf
D6 D20 = TPD1E0B04DPYR: Manufacturer: Texas Instruments; Supplier 1: Digi-Key; Supplier Part Number 1: 296-47864-1-ND; Stock 1: 6850; Pricing 1: 1=0.43, 10=0.346, 100=0.2353, 500=0.1765, 1000=0.1324 (USD); Manufacturer Part Number: TPD1E0B04DPYR
R28 R36 = Res 0805: Resistor; Manufacturer: Samsung; Manufacturer Part Number: RC1005F472CS; Description1: Res Thick Film 0402 4.7K Ohm 1% 1/16W ±100ppm/C Molded SMD T/R; Tolerance: 1 %; Power Rating: 1/16 W; Case Style: Molded; Temperature Coefficient: ±100 ppm/°C; Rad Hard: No; Lead Finish: Tin; Supplier 1: Digi-Key; Supplier Part Number 1: 1276-3466-1-ND; Stock 1: 3257499; Pricing 1: 1=0.1, 10=0.021, 100=0.0087, 1000=0.0039, 2500=0.0034, 5000=0.0028 (USD); Case Size: 0402; Packaging: Tape & Reel; Type: Thick Film; Operating Temperature: -55 to 155 °C; ComponentLink1URL: https://datasheet.ciiva.com/15196/getdatasheetpartid-636616-15196228.pdf; ComponentLink1Description: https://datasheet.ciiva.com/15196/getdatasheetpartid-636616-15196228.pdf; ComponentLink2URL: https://datasheet.ciiva.com/26185/chip-resistor-150112-1-26185621.pdf; ComponentLink2Description: https://datasheet.ciiva.com/26185/chip-resistor-150112-1-26185621.pdf
R29 R31-R35 R37 = Res 0805: Resistor; Manufacturer: Samsung; Manufacturer Part Number: RC1005F103CS; Description1: Res Thick Film 0402 10K Ohm 1% 0.063W(1/16W) ±100ppm/C Molded SMD T/R; Rated Power: 0.063 W; Tolerance (%): ±1 %; Temp Coefficient: ±100 ppm/°C; Supplier 1: Digi-Key; Supplier Part Number 1: 1276-3431-1-ND; Stock 1: 15935883; Pricing 1: 1=0.1, 10=0.021, 100=0.0087, 1000=0.0039, 2500=0.0034, 5000=0.0028 (USD); Size Code: 0402; ComponentLink1URL: https://datasheet.ciiva.com/15196/getdatasheetpartid-504789-15196214.pdf; ComponentLink1Description: https://datasheet.ciiva.com/15196/getdatasheetpartid-504789-15196214.pdf; ComponentLink2URL: https://datasheet.ciiva.com/16481/rcseries-16481007.pdf; ComponentLink2Description: https://datasheet.ciiva.com/16481/rcseries-16481007.pdf
R30 = Res 0805: Resistor; Manufacturer: Panasonic; Manufacturer Part Number: ERJ-2RKF2003X; Description1: Res Thick Film 0402 200K Ohm 1% 0.1W(1/10W) ±100ppm/C Molded SMD Automotive T/R; Rated Power: 0.1 W; Tolerance (%): ±1 %; Temp Coefficient: ±100 ppm/°C; Supplier 1: Digi-Key; Supplier Part Number 1: P200KLCT-ND; Stock 1: 1535285; Pricing 1: 1=0.1, 10=0.056, 100=0.0227, 1000=0.0102, 2500=0.0089, 5000=0.0073 (USD); Size Code: 0402; ComponentLink1URL: https://datasheet.ciiva.com/5868/426256-5868117.pdf; ComponentLink1Description: https://datasheet.ciiva.com/5868/426256-5868117.pdf; ComponentLink2URL: https://datasheet.ciiva.com/24073/aoa0000ce2-24073141.pdf; ComponentLink2Description: https://datasheet.ciiva.com/24073/aoa0000ce2-24073141.pdf; ComponentLink3URL: https://datasheet.ciiva.com/46387/426256-46387157.pdf; ComponentLink3Description: https://datasheet.ciiva.com/46387/426256-46387157.pdf; ComponentLink4URL: https://datasheet.ciiva.com/11821/0900766b80f80784-11821224.pdf; ComponentLink4Description: https://datasheet.ciiva.com/11821/0900766b80f80784-11821224.pdf; ComponentLink5URL: https://datasheet.ciiva.com/48531/aoa0000ce2-48531064.pdf; ComponentLink5Description: https://datasheet.ciiva.com/48531/aoa0000ce2-48531064.pdf; ComponentLink6URL: https://datasheet.ciiva.com/28675/1678782-28675803.pdf; ComponentLink6Description: https://datasheet.ciiva.com/28675/1678782-28675803.pdf; ComponentLink7URL: https://datasheet.ciiva.com/16775/70260748-16775805.pdf; ComponentLink7Description: https://datasheet.ciiva.com/16775/70260748-16775805.pdf; ComponentLink8URL: https://datasheet.ciiva.com/46374/426256-46374221.pdf; ComponentLink8Description: https://datasheet.ciiva.com/46374/426256-46374221.pdf; ComponentLink9URL: https://datasheet.ciiva.com/16759/70260748-16759806.pdf; ComponentLink9Description: https://datasheet.ciiva.com/16759/70260748-16759806.pdf
RF_CASE = SMS-462C: Manufacturer: Leader Tech FerriShield; Description1: LEADER TECH-FERRISHIELD         SMS-462C             SURFACE MOUNT SHIELD COVER, RECT                          New; Supplier 1: Digi-Key; Supplier Part Number 1: 1798-1236-ND; Stock 1: 778; Pricing 1: 1=0.93, 10=0.816, 25=0.7224, 100=0.6291, 250=0.5476, 500=0.466, 1000=0.3728, 2500=0.3379, 5000=0.3146 (USD); Manufacturer Part Number: SMS-462C
RFS1 = Component_1: Manufacturer: Leader Tech FerriShield; Description1: LEADER TECH-FERRISHIELD         SMS-462F             SURFACE MOUNT SHIELD FRAME, RECT                          New; Shielding Type: EMI Shielding; Product Range: Two-Piece SMS Series; Gasket Material: Tin Plated Steel; SVHC: No SVHC (17-Dec-2015); Supplier 1: Digi-Key; Supplier Part Number 1: 1798-1237-1-ND; Manufacturer Part Number: SMS-462F; Stock 1: 814; Pricing 1: 1=2.84, 10=2.567, 25=2.2916, 100=2.0626 (USD); Length: 27.18mm; Width: 70.05mm; Depth: 5.99mm; Attenuation: -
U5 = TSV321RILT: Manufacturer: STMicroelectronics; Description1: IC OPAMP GP 1.4MHZ RRO SOT23-5; Amplifier Type: General Purpose; Output Type: Rail-to-Rail; Slew Rate: 0.6 V/µs; Current - Supply: 500µA; Voltage - Supply, Single/Dual (±): 2.5 V ~ 6 V; Supplier 1: Digi-Key; Supplier Part Number 1: 497-8164-1-ND; Manufacturer Part Number: TSV321RILT; RoHS: RoHS Compliant; Category: Integrated Circuits (ICs); Stock 1: 75819; Pricing 1: 1=0.58, 10=0.494, 100=0.3692, 500=0.29004, 1000=0.22413 (USD); Packaging: Cut Tape (CT); Part Status: Active; Operating Temperature: -40°C ~ 125°C; Mounting Type: Surface Mount; Package / Case: SC-74A, SOT-753; Supplier Device Package: SOT-23-5; Base Part Number: TSV321; ComponentLink1URL: http://www.st.com/content/ccc/resource/technical/document/datasheet/4c/37/c9/ed/ee/b0/44/6d/CD00063292.pdf/files/CD00063292.pdf/jcr:content/translations/en.CD00063292.pdf; ComponentLink1Description: http://www.st.com/content/ccc/resource/technical/document/datasheet/4c/37/c9/ed/ee/b0/44/6d/CD00063292.pdf/files/CD00063292.pdf/jcr:content/translations/en.CD00063292.pdf

## Nets that join several sheets
+3.3V: Isolated USB (C57.1 OP1.1 OP2.6), DAQ System (R29.1)
GND: Isolated USB (C57.2 OP2.4), DAQ System (12 pins)

## Assembly variants
PRODUCTION: not fitted C79 J2 J7 R4 R12A R12B R12C R12D